# EAGLE design acoms_bec (EAGLE 9.3.0)
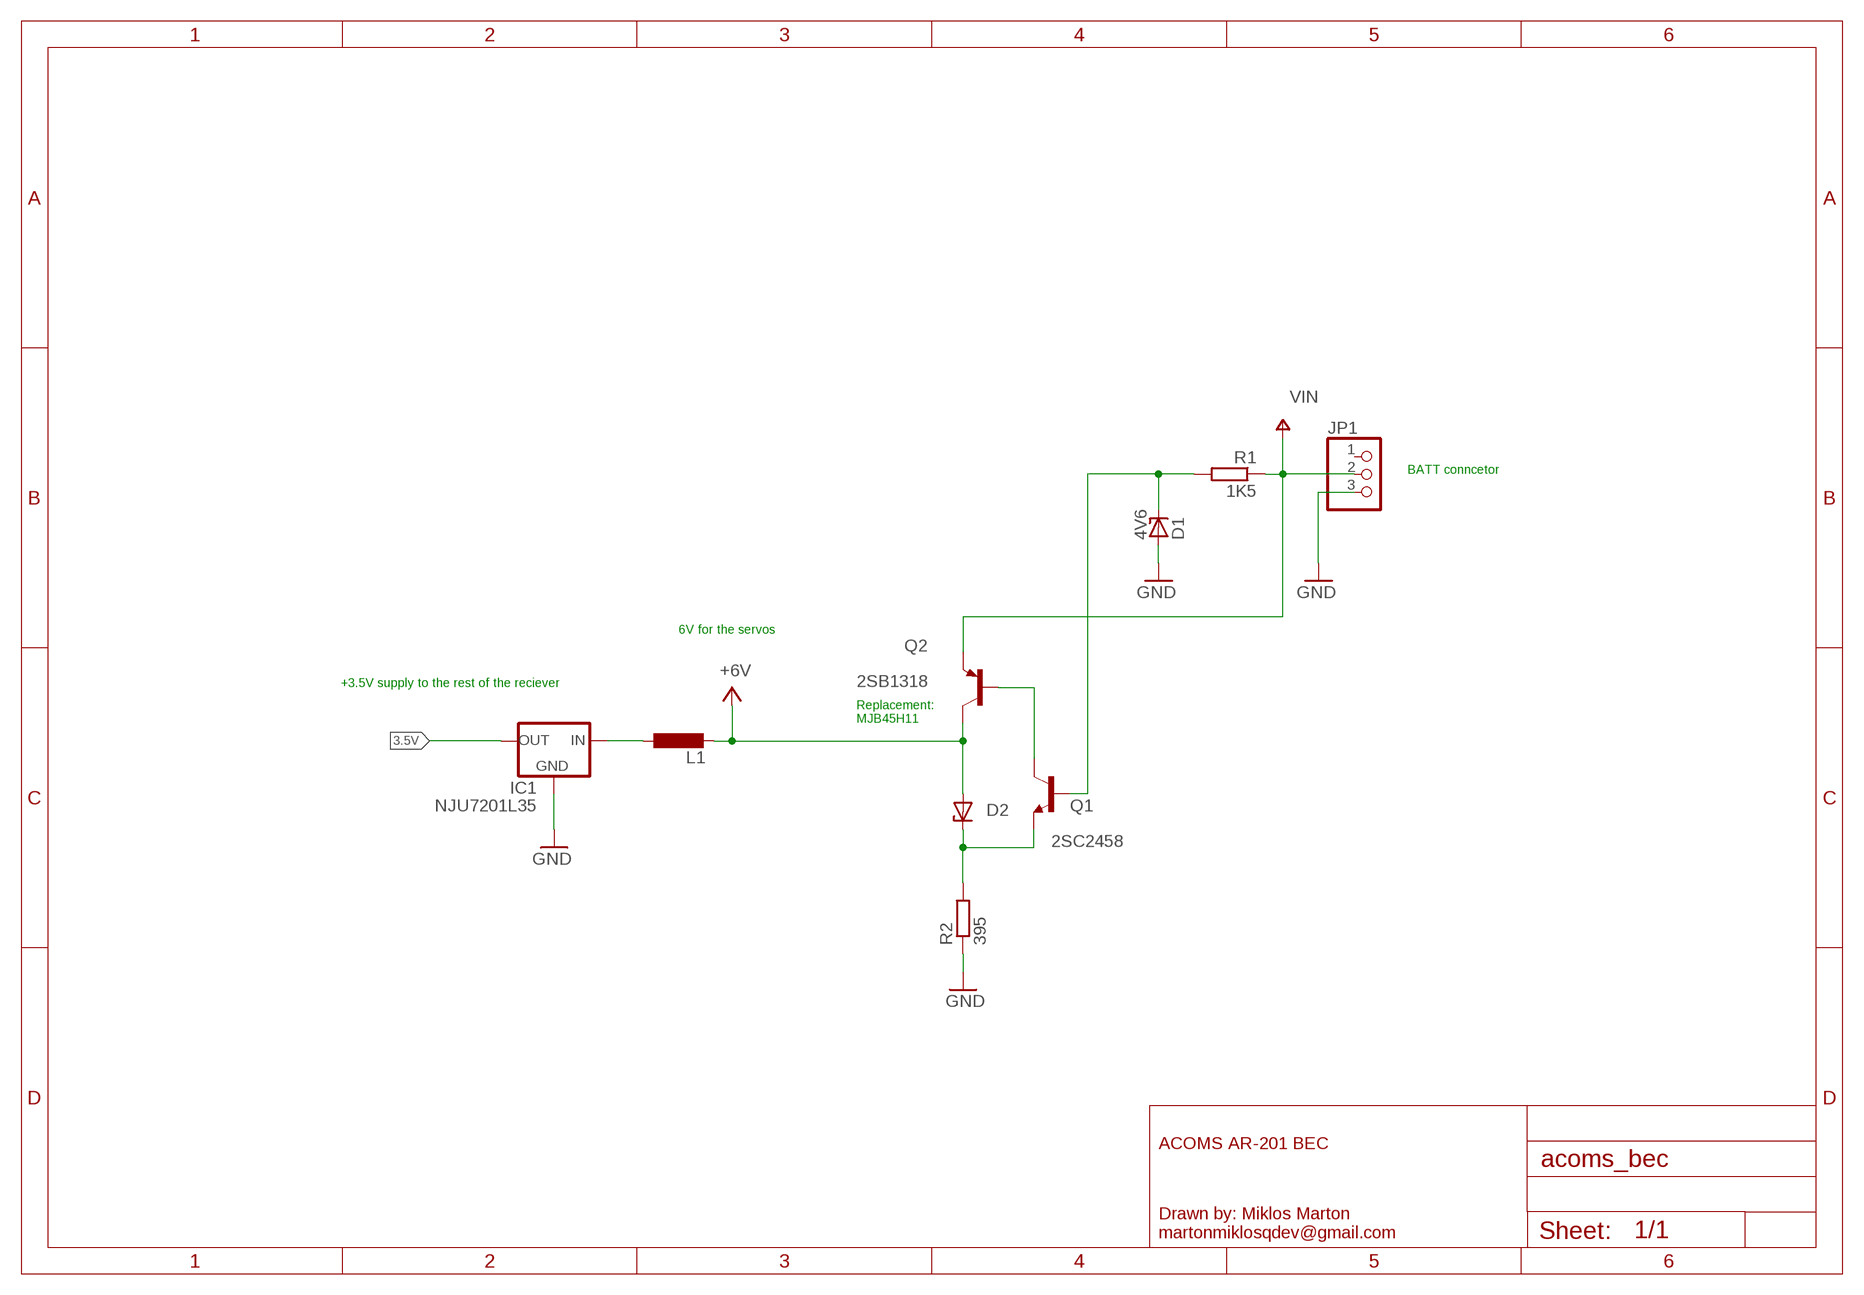
[diagram p0: schematic, sheet 1]

## Parts
D1  4V6  ZENER-DIODEZD-2.5  [ZDIO-2.5]
D2  ZENER-DIODEZD-2.5  [ZDIO-2.5]
IC1  NJU7201L35  V_REG_78XXTO-92  [TO-92]
JP1  PINHD-1X3  [1X03]
L1  L-EU0207/2V  [0207/2V]
Q1  2SC2458  TRANSISTOR_BJT_NPN-TO-92-ECB  [TO-92]
Q2  2SB1318  TRANSISTOR_BJT_PNP-TO-92-ECB  [TO-92]
R1  1K5  R-EU_0309/V  [0309V]
R2  395  R-EU_0309/V  [0309V]

## Nets
3.5V: IC1.3(OUT)
+6V: D2.A L1.2 Q2.2(C)
GND: D1.A IC1.1(GND) JP1.3 R2.1
N$3: IC1.2(IN) L1.1
N$4: Q1.2(C) Q2.3(B)
N$5: D2.C Q1.1(E) R2.2
N$6: D1.C Q1.3(B) R1.2
V+: JP1.2 Q2.1(E) R1.1 ; supply symbol labelled VIN
Unconnected: JP1.1

## Notes on the sheet
- BATT conncetor
- 6V for the servos
- +3.5V supply to the rest of the reciever
- Replacement:
  MJB45H11

## Library data of the parts
D1 D2 = diode:ZENER-DIODE: Z-Diode
IC1 = SparkFun:V_REG_78XX: Voltage Regulator Standard 7805 5V regulator. IGO (Input Ground Output). Spark Fun Electronics SKU : COM-00107
JP1 = pinhead:PINHD-1X3: PIN HEADER
L1 = rcl:L-EU: INDUCTOR, European symbol
Q1 = dp_devices:TRANSISTOR_BJT_NPN: Most commonly used is SOT23-BEC
Q2 = dp_devices:TRANSISTOR_BJT_PNP: Most commonly used is SOT23-BEC
R1 R2 = rcl:R-EU_: RESISTOR, European symbol

## Board
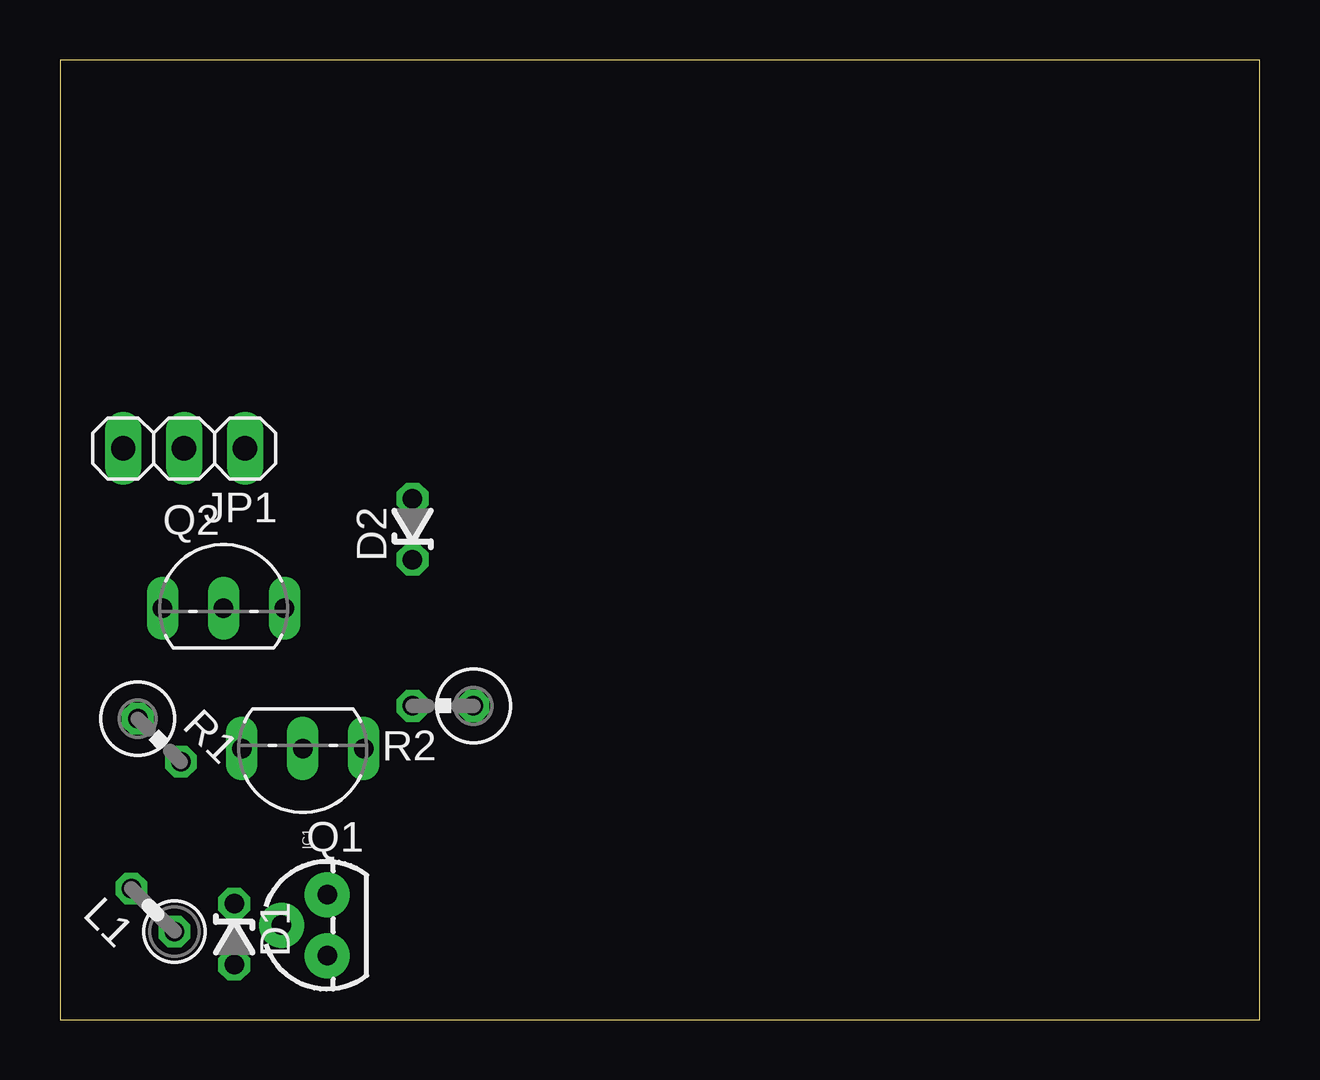
[diagram p1: board, top side]
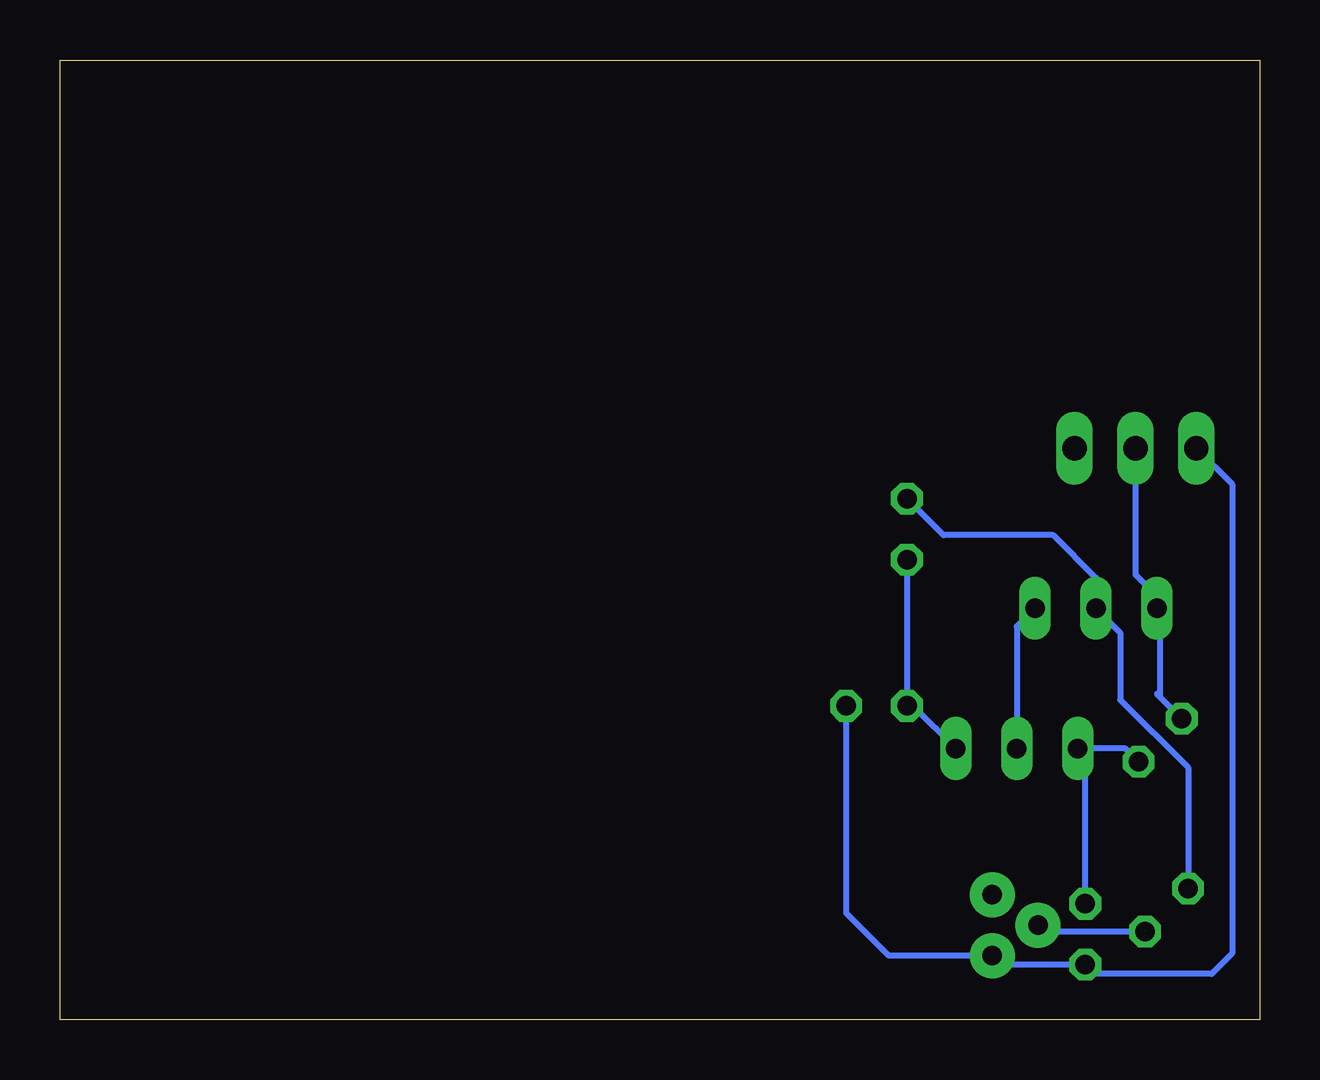
[diagram p2: board, bottom side, seen from below]

Size 50 x 40 mm. Coordinates in mm from the lower left corner, seen from the top.
Outline: 50,40 0,40 0,0 50,0 50,40
Copper layers (1*16): Top 0.035mm / dielectric 1.5mm / Bottom 0.035mm
Design rules "default": minimum track width 10mil, minimum drill 24mil, track to track 8mil, track to pad 8mil, pad to pad 8mil, via to via 8mil, smd to smd 8mil, copper to edge 40mil, drill to drill 8mil, minimum pad ring 10mil, minimum via ring 8mil, stop-mask expansion 4mil, vias tented up to drill 0mil, thermal gap 10mil

### Footprints (pad centres in the part's own frame; a part is rotated, then mirrored left to right if it is on the bottom)
ZDIO-2.5 = drill 0.813 octagon: A 1.27,0; C -1.27,0
TO-92 = drill 0.813 pad 1.88: 1 -1.27,0; 2 0,1.905; 3 1.27,0
1X03 = drill 1.016 long: 1 -2.54,0; 2 0,0; 3 2.54,0
0207/2V = drill 0.813 octagon: 1 -1.27,0; 2 1.27,0
TO-92' = drill 0.813 long: 1 -2.54,0; 2 0,0; 3 2.54,0
0309V = drill 0.813 octagon: 1 -1.27,0; 2 1.27,0

### Placement (x,y rotation side)
D1  7.26,3.56 270 top
D2  14.69,20.44 90 top
IC1  11.14,3.93 90 top
JP1  5.17,23.81 180 top
L1  3.87,4.57 135 top
Q1  2SC2458  [TO-92']  10.12,11.3 180 top
Q2  2SB1318  [TO-92']  6.82,17.14 0 top
R1  4.14,11.64 315 top
R2  15.96,13.08 180 top

### Tracks (layer width: path | path; a pad name or v marks a point on that pad's centre or on a via)
+6V
  Bottom 0.254: D2.A 13.17,20.19 8.6,20.19 6.82,18.41 Q2.2 5.8,16.12 5.8,13.33 2.98,10.5 L1.2
GND
  Bottom 0.254: JP1.3 1.14,22.32 1.14,2.75 1.99,1.9 6.88,1.9 D1.A 10.76,2.29 IC1.1 15.46,2.66 17.23,4.44 R2.1
N$3  (1 unrouted)
  Bottom 0.254: IC1.2 8.98,3.68 L1.1
N$4
  Bottom 0.254: Q2.3 10.12,16.38 Q1.2
N$5
  Bottom 0.254: Q1.1 14.44,13.08 R2.2 D2.C
N$6
  Bottom 0.254: R1.2 5.59,11.3 Q1.3 7.26,10.98 D1.C
V+
  Bottom 0.254: R1.1 4.16,13.45 | 4.16,13.45 4.28,13.58 | 4.16,13.45 4.16,17.02 Q2.1 4.28,17.65 5.17,18.54 JP1.2